# EAGLE design Noduino-Open-Plug (EAGLE 6.6.0)
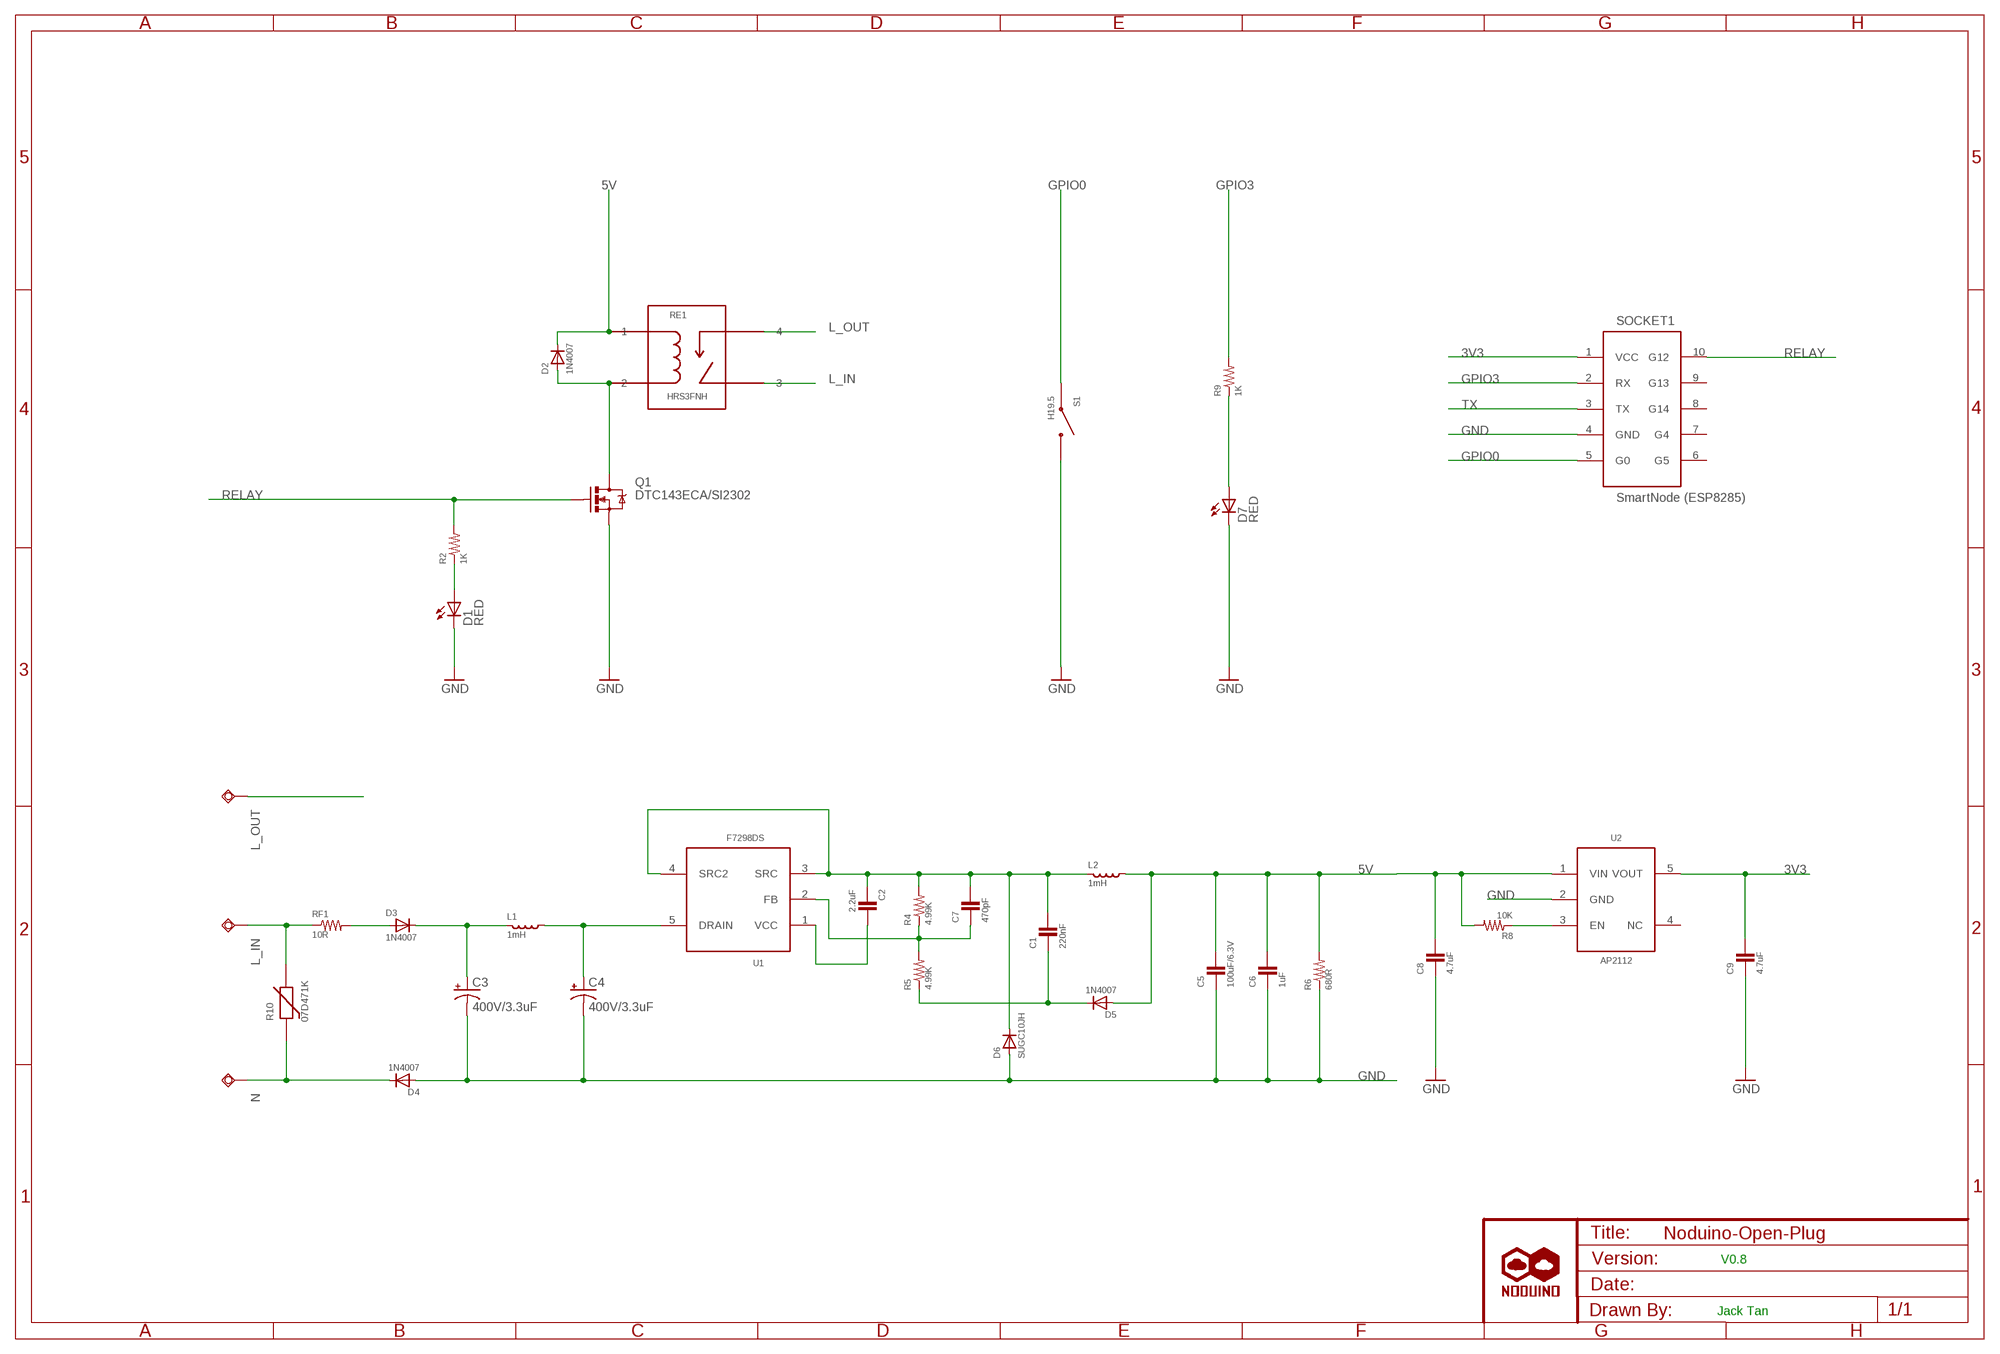
[diagram p0: schematic, sheet 1]

## Parts
C1  220nF  0402-CAP  [0402-CAP]
C2  2.2uF  0603-CAP  [0603-CAP]
C3  400V/3.3uF  CAP_POL  [CPOL-RADIOA-3.3UF-400V]
C4  400V/3.3uF  CAP_POL  [CPOL-RADIOA-3.3UF-400V]
C5  100uF/6.3V  B3528-CAP  [B3528-CAP]
C6  1uF  0402-CAP  [0402-CAP]
C7  470pF  0402-CAP  [0402-CAP]
C8  4.7uF  0603-CAP  [0603-CAP]
C9  4.7uF  0603-CAP  [0603-CAP]
D1  RED  LED3MM  [LED3MM]
D2  1N4007  DIODESOD  [SOD-323]
D3  1N4007  DIODEHV  [DO-214]
D4  1N4007  DIODEHV  [DO-214]
D5  1N4007  DIODEHV  [DO-214]
D6  SUGC10JH  [SOD-123]
D7  RED  LED3MM  [LED3MM]
L1  1mH  INDUCTOR3-0.5-5  [3-0.5-5]
L2  1mH  INDUCTOR  [INDUCTOR-5-0.5]
L_IN  TESTPAD50/25  [1SMD]
L_OUT  TESTPAD50/25  [1SMD]
N  TESTPAD50/25  [1SMD]
Q1  DTC143ECA/SI2302  MOSFET-N-SMD  [SOT23-3]
R2  1K  0603-RESISTOR  [0603-RES]
R4  4.99K  0402-RESISTOR  [0402-RES]
R5  4.99K  0402-RESISTOR  [0402-RES]
R6  680R  0402-RESISTOR  [0402-RES]
R8  10K  0603-RESISTOR  [0603-RES]
R9  1K  0603-RESISTOR  [0603-RES]
R10  07D471K  [07D471K]
RE1  HRS3FNH  HKE-HRS3FNH  [HKE-HRS3FN]
RF1  10R  RESISTOR  [3-0.5-5]
S1  H19.5  SWITCH-4DIPTS-037-PLUG  [SWITCH-TS-037-PLUG]
SOCKET1  SmartNode (ESP8285)  MOD-PLUG-SOCKET  [MOD-PLUG-SOCKET]
U1  F7298  [SOT23-5]
U2  AP2112  [SOT23-5]
U$1  NODUINO-LOGO-ALL  [NODUINO-ALL-1]

## Nets
3V3: C9.2 SOCKET1.1(VCC) U2.5(VOUT)
5V: C5.2 C6.2 C8.2 D2.1(C) D5.A L2.P$2(X2) R6.2 R8.2 RE1.1 U2.1(VIN)
GND: C3.P$2(-) C4.P$2(-) C5.1 C6.1 C8.1 C9.1 D1.K(C) D4.A D6.A D7.K(C) Q1.2(S) R6.1 S1.P$1 SOCKET1.4(GND) U2.2(GND)
GPIO0: S1.P$3 SOCKET1.5(G0)
GPIO3: R9.2 SOCKET1.2(RX)
L_IN: L_IN.1(PP) R10.P$2 RE1.3 RF1.P$1
L_OUT: L_OUT.1(PP) RE1.4
N: D4.C N.1(PP) R10.P$1
N$2: D2.2(A) Q1.3(D) RE1.2
N$3: C3.P$1(+) D3.C L1.P$1(X1)
N$4: D1.A R2.1
N$5: C4.P$1(+) L1.P$2(X2) U1.5(DRAIN)
N$6: C1.2 C2.1 C7.2 D6.C L2.P$1(X1) R4.2 U1.3(SRC) U1.4(SRC2)
N$7: D3.A RF1.P$2
N$10: C2.2 U1.1(VCC)
N$11: C7.1 R4.1 R5.2 U1.2(FB)
N$12: C1.1 D5.C R5.1
N$13: R8.1 U2.3(EN)
N$14: D7.A R9.1
RELAY: Q1.1(G) R2.2 SOCKET1.10(G12)
TX: SOCKET1.3(TX)
Unconnected: SOCKET1.6(G5) SOCKET1.7(G4) SOCKET1.8(G14) SOCKET1.9(G13) U2.4(NC)

## Notes on the sheet
- V0.8
- Jack Tan

## Library data of the parts
C1 C6 C7 = ehl:0402-CAP
C2 C8 C9 = ehl:0603-CAP
C3 C4 = ehl:CAP_POL: Capacitor Polarized These are standard SMD and PTH capacitors. Normally 10uF, 47uF, and 100uF in electrolytic and tantalum varieties. Always verify the external diameter of the through hole cap, it varies with capacity, voltage, and manufacturer. The EIA devices should be standard.
C5 = ehl:B3528-CAP
D1 D7 = adafruit:LED: LED OSRAM: - CHIPLED LG R971, LG N971, LY N971, LG Q971, LY Q971, LO R971, LY R971 LH N974, LH R974 LS Q976, LO Q976, LY Q976 LO Q996 - Hyper CHIPLED LW Q18S LB Q993, LB Q99A, LB R99A - SideLED LS A670, LO A670, LY A670, LG A670, LP A670 LB A673, LV A673, LT A673, LW A673 LH A674 LY A675 LS A676, LA A676, LO A676, LY A676, LW A676 LS A679, LY A679, LG A679 - Hyper Micro SIDELED® LS Y876, LA Y876, LO Y876, LY Y876 LT Y87S - SmartLED LW L88C, LW L88S LB L89C, LB L89S, LG L890 LS L89K, LO L89K, LY L89K LS L896, LA L896, LO L896, LY L896 - TOPLED LS T670, LO T670, LY T670, LG T670, LP T670 LSG T670, LSP T670, LSY T670, LOP T670, LYG T670 LG T671, LOG T671, LSG T671 LB T673, LV T673, LT T673, LW T673 LH T674 LS T676, LA T676, LO T676, LY T676, LB T676, LH T676, LSB T676, LW T676 LB T67C, LV T67C, LT T67C, LS T67K, LO T67K, LY T67K, LW E67C LS E67B, LA E67B, LO E67B, LY E67B, LB E67C, LV E67C, LT E67C LW T67C LS T679, LY T679, LG T679 LS T770, LO T770, LY T770, LG T770, LP T770 LB T773, LV T773, LT T773, LW T773 LH T774 LS E675, LA E675, LY E675, LS T675 LS T776, LA T776, LO T776, LY T776, LB T776 LHGB T686 LT T68C, LB T68C - Hyper Mini TOPLED® LB M676 - Mini TOPLED Santana® LG M470 LS M47K, LO M47K, LY M47K Source: http://www.osram.convergy.de/
D2-D5 = ehl:DIODE: Diode These are standard reverse protection diodes and small signal diodes. SMA package can handle up to about 1A. SOD-323 can handle about 200mA. What the SOD-323 package when ordering, there are some mfgs out there that are 5-pin packages.
D6 = ehl:SUGC10JH
L1 L2 = ehl:INDUCTOR
L_IN L_OUT N = ehl:TESTPAD: drill 40mils, diameter 70mils
Q1 = ehl:MOSFET-N
R2 R8 R9 = ehl:0603-RESISTOR
R4-R6 = ehl:0402-RESISTOR
R10 = ehl:07D471K
RE1 = ehl:HKE-HRS3FNH
RF1 = ehl:RESISTOR
S1 = ehl:SWITCH-4DIP
SOCKET1 = ehl:MOD-PLUG-SOCKET
U1 = ehl:F7298
U2 = ehl:AP2112
U$1 = ehl:NODUINO-LOGO-ALL

## Board
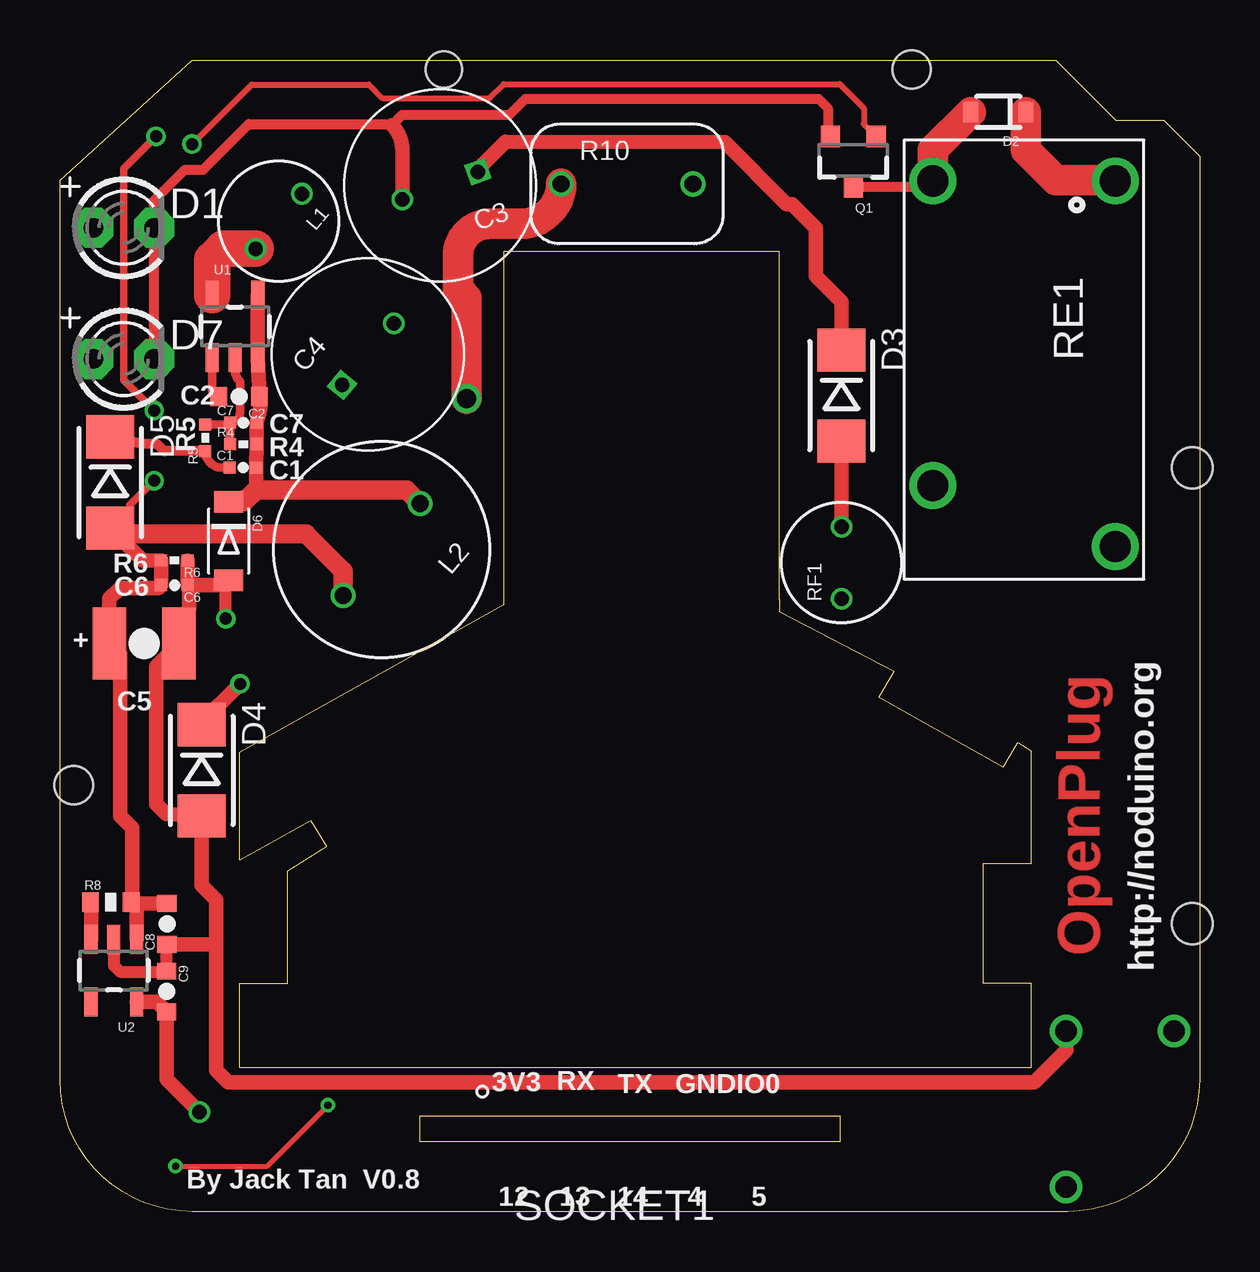
[diagram p1: board, top side]
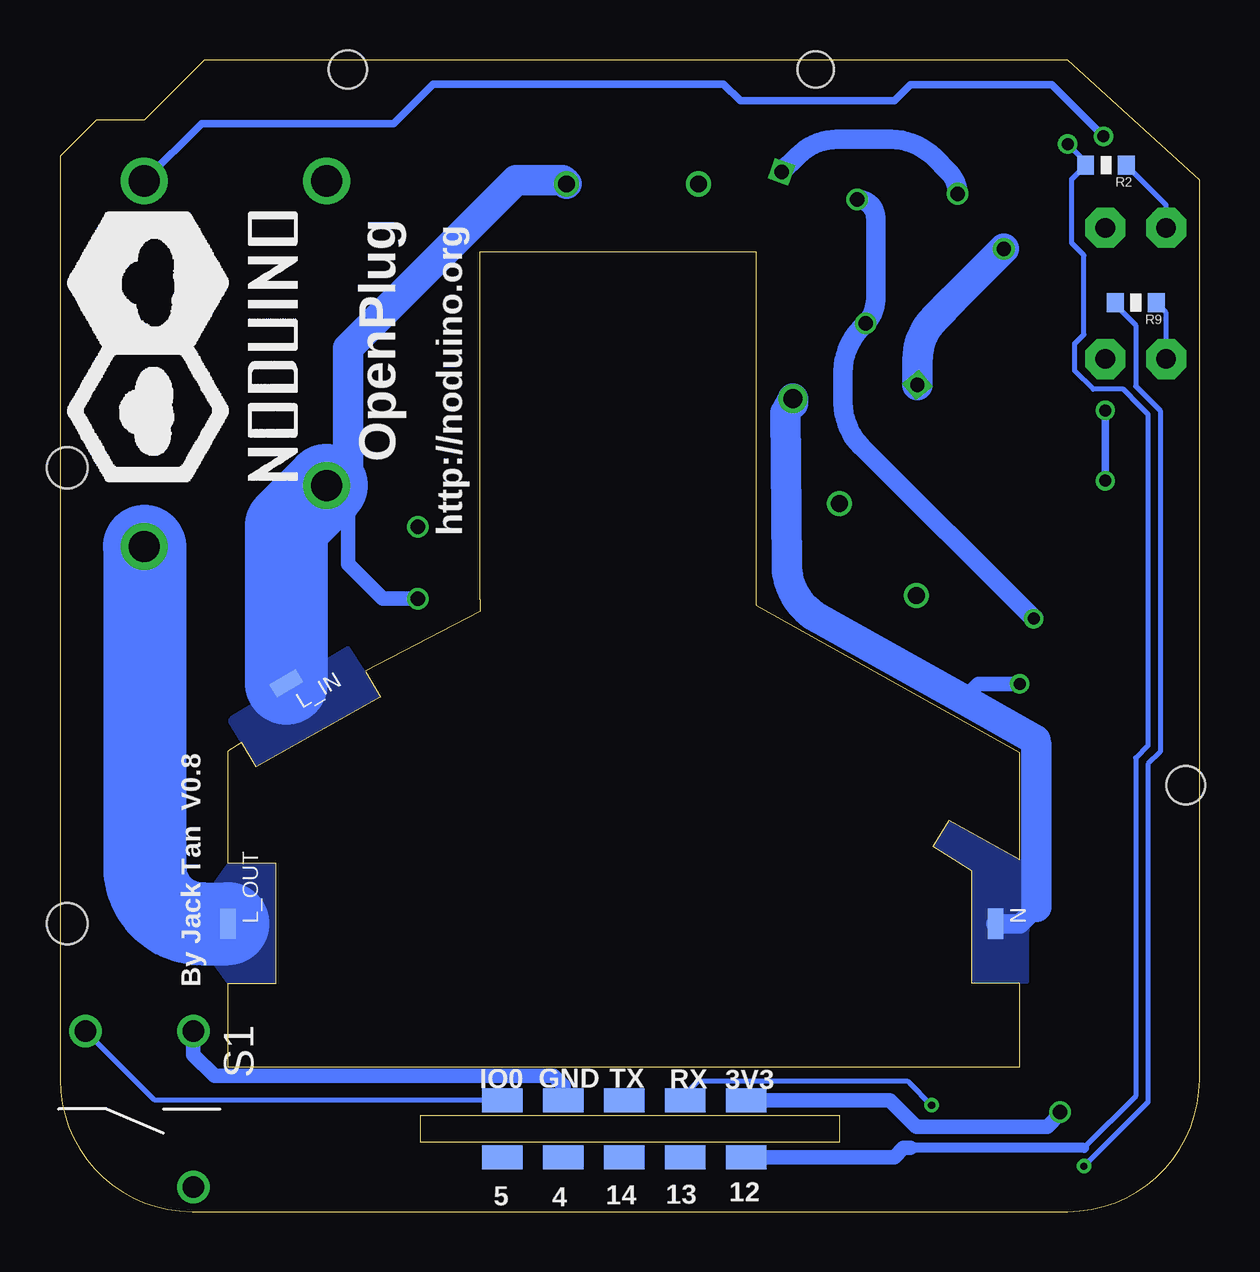
[diagram p2: board, bottom side, seen from below]

Size 47.5 x 48 mm. Coordinates in mm from the lower left corner, seen from the top.
Outline: 47.5,44 47.5,5.5 arc-90 42,0 5.5,0 arc-90 0,5.5 0,43 5.5,48 41.5,48 44,45.5 46,45.5 47.5,44
Copper layers (1*16): Top 0.035mm / dielectric 1.5mm / Bottom 0.035mm
Design rules "jackslab-micromod": minimum track width 6mil, minimum drill 0.3mm, track to track 6mil, track to pad 6mil, pad to pad 6mil, via to via 6mil, smd to smd 6mil, copper to edge 6mil, drill to drill 6mil, minimum pad ring 6mil, minimum via ring 6mil, stop-mask expansion 4mil, vias tented up to drill 20mil, thermal gap 6mil
Holes 1.5 mm at 16,47.6
Holes 1.6 mm at 35.5,47.6 0.58,17.77
Holes 1.7 mm at 47.2,31 47.2,12
Milling: 25 lines

### Footprints (pad centres in the part's own frame; a part is rotated, then mirrored left to right if it is on the bottom)
0402-CAP = smd 0.5 x 0.5: 1 -0.55,0; 2 0.55,0
0603-CAP = smd 0.7 x 0.8: 1 -0.85,0; 2 0.85,0
CPOL-RADIOA-3.3UF-400V = drill 0.6 square: P$1 -1.675,0 | drill 0.6: P$2 1.675,0
B3528-CAP = smd 1.4 x 3: 1 -1.45,0; 2 1.45,0
LED3MM = drill 0.813 pad 1.676 octagon: A -1.27,0; K 1.27,0
SOD-323 = smd 0.63 x 0.83: 1 -1.15,0; 2 1.15,0
DO-214 = smd 1.8 x 2: A 1.9,0; C -1.9,0
SOD-123 = smd 0.91 x 1.22: A 1.637,0; C -1.637,0
3-0.5-5 = drill 0.6: P$1 -1.5,0; P$2 1.5,0
INDUCTOR-5-0.5 = drill 0.7: P$1 -2.5,0; P$2 2.5,0
1SMD = smd 1.27 x 0.635: 1 0,0
SOT23-3 = smd 0.8 x 0.9: 1 -0.95,-1; 2 0.95,-1; 3 0,1.1
0603-RES = smd 0.7 x 0.8: 1 -0.85,0; 2 0.85,0
0402-RES = smd 0.5 x 0.5: 1 -0.55,0; 2 0.55,0
07D471K = drill 0.7: P$1 -2.75,0; P$2 2.75,0
HKE-HRS3FN = drill 1.3: 1 0,7.6; 2 0,0; 3 12.7,0; 4 15.24,7.6
SWITCH-TS-037-PLUG = drill 0.9: P$1 -3.25,2.25; P$2 3.25,2.25; P$3 -3.25,-2.25
MOD-PLUG-SOCKET = smd 1.7 x 1 bottom: 1 13.6,-1.14; 2 11.06,-1.14; 3 8.52,-1.14; 4 5.98,-1.14; 5 3.44,-1.14; 6 3.44,1.24; 7 5.98,1.24; 8 8.52,1.24; 9 11.06,1.24; 10 13.6,1.24
SOT23-5 = smd 0.55 x 1.2: 1 -0.95,-1.3; 2 0,-1.3; 3 0.95,-1.3; 4 0.95,1.3; 5 -0.95,1.3

### Placement (x,y rotation side)
C1  7.63,31.01 0 top
C2  7.46,33.96 180 top
C3  15.85,42.76 200 top
C4  12.84,35.73 50 top
C5  3.51,23.68 180 top
C6  4.78,26.11 180 top
C7  7.65,32.88 0 top
C8  4.46,11.99 90 top
C9  4.45,9.17 270 top
D1  2.66,41.01 0 top
D2  39.12,45.83 180 top
D3  32.56,34.01 270 top
D4  5.91,18.39 270 top
D5  2.09,30.39 270 top
D6  7.03,27.95 270 top
D7  2.66,35.54 0 top
L1  9.12,41.27 230 top
L2  13.4,27.6 230 top
L_IN  38.06,22.02 31 bottom
L_OUT  40.5,12 90 bottom
N  8.5,12 90 bottom
Q1  33.07,43.81 180 top
R2  3.9,43.62 180 bottom
R4  7.65,31.98 0 top
R5  6.06,32.25 90 top
R6  4.77,27.14 180 top
R8  2.12,12.9 0 top
R9  2.66,37.88 180 bottom
R10  23.64,42.83 0 top
RE1  36.39,42.96 270 top
RF1  32.58,27.04 90 top
S1  44.19,4.28 270 bottom
SOCKET1  32.5,3.5 180 top
U1  7.3,36.89 0 top
U2  2.24,10.05 180 top
U$1  36.92,30.06 90 bottom

### Tracks (layer width: path | path; a pad name or v marks a point on that pad's centre or on a via)
3V3  (via drill 0.6)
  Top 0.61: U2.5 4.02,8.75 C9.2 4.45,5.51 v5.82,4.14
  Bottom 0.61: v5.82,4.14 5.82,4.07 6.34,3.54 11.8,3.54 12.9,4.64 SOCKET1.1
5V  (via drill 0.5)
  Top 0.305: D5.A 2.15,28.43 2.4,28.25 2.91,28.69 2.91,29.45 v3.93,30.46 | v3.93,33.39 2.66,34.66 2.66,43.47 v4,44.81
  Top 0.61: U2.1 3.19,12.67 R8.2 | C8.2 3.03,12.84 R8.2 | R8.2 3,12.93 3,16 2.5,16.5 2.5,23.23 C5.2 2.05,25.55 2.5,26 4.12,26 C6.2 4.23,27.13 R6.2 3.44,27.14 D5.A
  Top 0.813: L2.P$2 11.8,26.7 10.26,28.24 2.4,28.25
  Top 1.27: D2.1 40.27,44.23 41.5,43 43.95,43 RE1.1
  Bottom 0.305: RE1.1 41.6,45.35 33.59,45.35 31.94,47 19.84,47 19.14,46.3 12.72,46.3 12.05,46.97 6.16,46.97 v4,44.81 | v3.93,30.46 v3.93,33.39
GND  (via drill 0.5)
  Top 0.305: 13.81,45.32 13.84,45.29 | 3.94,41 D1.K
  Top 0.406: 13.84,45.29 14.27,45.72 18.74,45.72 19.4,46.38 31.62,46.38 32,46 32,44.93 Q1.2 | D1.K 3.93,42.15 5.2,43.42 5.96,43.42 7.87,45.32 13.81,45.32 | 3.94,41 D7.K
  Top 0.508: U2.2 2.25,10.26 2.5,10 4.43,10 C9.1 4.45,11.12 C8.1 | v6.91,24.71 6.91,26.19 D6.A
  Top 0.61: 6.5,11 6.5,13 5.91,13.59 D4.A 4.42,16.58 4,17 4,22.73 C5.1 4.96,24.67 5.39,25.11 5.39,26.05 C6.1 | 6.5,11 6.5,5.88 7,5.38 40.61,5.38 41.94,6.71 S1.P$1 | C8.1 6.36,11.14 6.5,11 | C6.1 5.33,27.13 R6.1 | C6.1 6.83,26.11 D6.A | C3.P$2 14.27,44.25 arc45 13.84,45.29
  Bottom 0.61: SOCKET1.4 26.52,5.24 26.93,5.65 41.06,5.65 41.95,6.54 41.95,7.52 S1.P$1
  Bottom 0.813: v6.91,24.71 14.11,31.91 arc45 14.86,33.71 14.86,35.02 arc45 14.11,36.81 C4.P$2 arc-45 13.5,38.01 13.5,41.42 arc-90 C3.P$2
GPIO0
  Bottom 0.203: SOCKET1.5 43.55,4.64 S1.P$3
GPIO3  (via drill 0.3)
  Top 0.203: v4.82,1.89 8.63,1.89 v11.17,4.43
  Bottom 0.203: R9.2 3.48,37.88 3.48,37.76 2.66,36.94 2.66,34.4 1.64,33.38 1.64,19.16 2.15,18.65 2.15,4.56 v4.82,1.89 | 12.06,5.32 v11.17,4.43 12.18,5.44 20.89,5.44 21.44,4.89 SOCKET1.2
L_IN
  Bottom 0.61: RF1.P$1 34.04,25.54 35.5,27 35.5,29.38 RE1.3
  Bottom 1.27: RE1.3 36.24,30.26 35.5,31 35.5,36 28.5,43 26.55,43 R10.P$2
  Bottom 3.454: RE1.3 38.06,28.58 L_IN.1
  pour Bottom (isolate 0.152, no thermals): 34.84,22.51 35.48,23.52 40.34,20.6 40.44,20.46 39.32,18.61 34.23,21.49
L_OUT
  Bottom 3.454: L_OUT.1 41.61,12 arc90 43.96,14.35 43.96,27.69 RE1.4
  pour Bottom (isolate 0.152, no thermals): 38.55,14.43 40.51,14.43 41.04,13.7 41.01,10.26 40.49,9.55 38.54,9.56
N  (via drill 0.5, 0.8)
  Top 0.406: D4.C 5.88,20.38
  Top 0.61: 5.88,20.38 v7.5,22
  Top 1.27: R10.P$1 arc-90 19.23,41.17 17.91,41.17 arc90 16.59,39.85 16.59,38.47 arc90 16.78,38.27 16.78,38.24 arc90 16.95,38.07 v16.95,33.88
  Bottom 0.61: v7.5,22 9.22,22 9.86,21.36
  Bottom 0.813: 6.81,12.69 7.5,12 N.1
  Bottom 1.27: 16.95,33.68 v16.95,33.88 17.25,33.3 17.2,26.93 arc-60 15.9,24.73 9.86,21.36 6.83,19.67 6.83,19.46 6.81,19.44 6.81,12.69
  pour Bottom (isolate 0.152, no thermals): 7.11,14.42 10.43,16.23 11.03,15.22 9.72,14.42 9.43,14.23 9.43,9.56 7.16,9.55 7.14,13.78
N$2
  Top 0.254: 38,45.5 38,45.8 D2.2
  Top 0.406: Q1.3 36.14,42.71 RE1.2
  Top 1.27: RE1.2 36.39,44.25 D2.2
N$3
  Top 0.61: D3.C 32.56,37.94 31.5,39 31.5,41 30.5,42 30.29,42 27.73,44.56 18.58,44.58 17.48,43.48 arc45 C3.P$1
  Bottom 0.813: L1.P$1 arc-45 10.47,43.35 11.06,43.94 arc-45 12.86,44.69 15.11,44.69 arc-45 16.75,44.01 C3.P$1
N$4
  Bottom 0.203: D1.A 1.39,41.96 R2.1
N$5
  Top 1.524: L1.P$2 6.8,40.13 6.34,39.67 U1.5
  Bottom 1.27: L1.P$2 9.94,38.34 10.26,38.02 11.02,37.27 arc-45 11.76,35.47 C4.P$1
N$6
  Top 0.406: 8.18,30.85 C1.2
  Top 0.508: D6.C 7.69,29.59 | C1.2
  Top 0.61: U1.4 U1.3 C2.1 arc-31 C7.2 R4.2 C1.2 | 8.18,30.08 C1.2
  Top 0.813: 7.69,29.59 8.18,30.08 14.44,30.08 L2.P$1
N$7
  Top 0.61: RF1.P$2 32.58,32.1 D3.A
N$10
  Top 0.356: U1.1 6.35,34.23 arc90 C2.2
N$11
  Top 0.356: R5.2 7.01,32.8 arc90 C7.1 | R4.1 arc90 R4.1 | R4.1 C7.1 | C7.1 arc90 7.5,33.28 7.5,34.6 arc-45 7.3,35.09 U1.2
  Top 0.406: 7.05,32.88 C7.1
N$12
  Top 0.356: R5.1 arc90 6.75,31.01 C1.1
  Top 0.406: C1.1 7.03,31.01 | R5.1 4.35,31.7 4.06,31.99 3.41,31.99 D5.C
N$13
  Top 0.61: U2.3 1.29,12.87 R8.1
N$14
  Bottom 0.203: 1.79,37.67 R9.1 1.39,37.47 D7.A
RELAY  (via drill 0.5)
  Top 0.254: Q1.1 33.5,45.33 33.5,46 32.5,47 18.5,47 17.91,46.41 13.44,46.41 12.88,46.97 7.99,46.97 5.52,44.5 v5.5,44.5
  Bottom 0.203: 4.75,43.75 v5.5,44.5 | R2.2 5.33,43.04 5.33,40.37 4.82,39.86 4.82,36.56 5.2,36.18 5.2,35.04 4.44,34.27 3.17,34.27 2.84,33.95 2.84,33.93 2.15,33.24 2.15,31.18 2.15,19.42 2.66,18.91 2.66,4.81 4.82,2.65
  Bottom 0.254: R2.2 4.75,43.75
  Bottom 0.406: 4.82,2.65 12.06,2.65
  Bottom 0.61: 12.06,2.65 12.33,2.65 12.72,2.26 SOCKET1.10

### Text on the board
Top: OpenPlug
tPlace: C2 | R5 | C7 | R4 | C1 | R6 | C6 | + | C5 | http://noduino.org | 3V3 | RX | TX | GND | IO0 | By Jack Tan V0.8 | 12 | 13 | 14 | 4 | 5
bPlace: OpenPlug | http://noduino.org | By Jack Tan V0.8 | 3V3 | RX | TX | GND | IO0 | 12 | 13 | 14 | 4 | 5